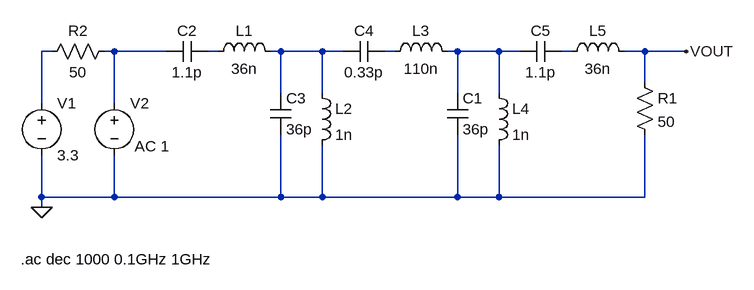
[diagram p0: schematic ANT_BANDPASS.asc]
ANT_BANDPASS.asc, the LTspice schematic file:
Version 4.1
SHEET 1 1480 680
WIRE 192 32 176 32
WIRE 288 32 272 32
WIRE 368 32 288 32
WIRE 448 32 432 32
WIRE 544 32 528 32
WIRE 608 32 544 32
WIRE 640 32 608 32
WIRE 720 32 704 32
WIRE 816 32 800 32
WIRE 880 32 816 32
WIRE 912 32 880 32
WIRE 992 32 976 32
WIRE 1104 32 1072 32
WIRE 1168 32 1104 32
WIRE 1104 80 1104 32
WIRE 544 96 544 32
WIRE 608 96 608 32
WIRE 816 96 816 32
WIRE 880 96 880 32
WIRE 176 112 176 32
WIRE 288 112 288 32
WIRE 176 256 176 192
WIRE 288 256 288 192
WIRE 288 256 176 256
WIRE 544 256 544 160
WIRE 544 256 288 256
WIRE 608 256 608 176
WIRE 608 256 544 256
WIRE 816 256 816 160
WIRE 816 256 608 256
WIRE 880 256 880 176
WIRE 880 256 816 256
WIRE 1104 256 1104 160
WIRE 1104 256 880 256
WIRE 176 272 176 256
FLAG 176 272 0
FLAG 1168 32 VOUT
SYMBOL voltage 288 96 R0
WINDOW 3 30 106 Left 2
WINDOW 123 31 82 Left 2
WINDOW 39 24 152 Left 2
SYMATTR InstName V2
SYMATTR Value ""
SYMATTR Value2 AC 1
SYMBOL cap 432 16 R90
WINDOW 0 0 32 VBottom 2
WINDOW 3 32 32 VTop 2
SYMATTR InstName C2
SYMATTR Value 1.1p
SYMBOL ind 432 48 R270
WINDOW 0 32 56 VTop 2
WINDOW 3 5 56 VBottom 2
SYMATTR InstName L1
SYMATTR Value 36n
SYMBOL cap 528 96 R0
SYMATTR InstName C3
SYMATTR Value 36p
SYMBOL ind 592 80 R0
SYMATTR InstName L2
SYMATTR Value 1n
SYMBOL cap 704 16 R90
WINDOW 0 0 32 VBottom 2
WINDOW 3 32 32 VTop 2
SYMATTR InstName C4
SYMATTR Value 0.33p
SYMBOL ind 704 48 R270
WINDOW 0 32 56 VTop 2
WINDOW 3 5 56 VBottom 2
SYMATTR InstName L3
SYMATTR Value 110n
SYMBOL cap 800 96 R0
SYMATTR InstName C1
SYMATTR Value 36p
SYMBOL ind 864 80 R0
SYMATTR InstName L4
SYMATTR Value 1n
SYMBOL cap 976 16 R90
WINDOW 0 0 32 VBottom 2
WINDOW 3 32 32 VTop 2
SYMATTR InstName C5
SYMATTR Value 1.1p
SYMBOL ind 976 48 R270
WINDOW 0 32 56 VTop 2
WINDOW 3 5 56 VBottom 2
SYMATTR InstName L5
SYMATTR Value 36n
SYMBOL res 1088 64 R0
SYMATTR InstName R1
SYMATTR Value 50
SYMBOL res 288 16 R90
WINDOW 0 0 56 VBottom 2
WINDOW 3 32 56 VTop 2
SYMATTR InstName R2
SYMATTR Value 50
SYMBOL voltage 176 96 R0
SYMATTR InstName V1
SYMATTR Value 3.3
TEXT 144 352 Left 2 !.ac dec 1000 0.1GHz 1GHz

The netlist it stands for:
* ANT_BANDPASS.asc
V2 N002 0 AC 1
C2 N003 N002 1.1p
L1 N003 N004 36n
C3 N004 0 36p
L2 N004 0 1n
C4 N005 N004 0.33p
L3 N005 N006 110n
C1 N006 0 36p
L4 N006 0 1n
C5 N007 N006 1.1p
L5 N007 VOUT 36n
R1 VOUT 0 50
R2 N002 N001 50
V1 N001 0 3.3
.ac dec 1000 0.1GHz 1GHz
.backanno
.end